# Altium schematic sheet 2.Connectors.SchDoc
size A4; SheetNumber: 3; SheetTotal: 13
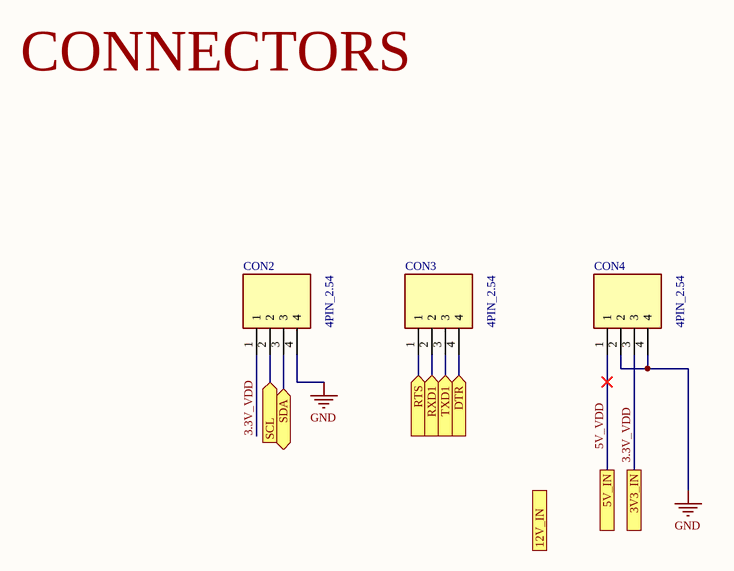
[diagram p0: 2.Connectors.SchDoc]

## Parts
CON2  4PIN_2.54  [4Pin_2.5]
CON3  4PIN_2.54  [4Pin_2.5]
CON4  4PIN_2.54  [4Pin_2.5]

## Ports
3V3_IN, 5V_IN, 12V_IN, DTR (in), RTS (in), RXD1 (in), SCL (in), SDA (bidir), TXD1 (in)

## Nets
GND: CON2.4 CON4.2 CON4.4
3.3V_VDD: CON2.1 CON4.3 ; port 3V3_IN
5V_VDD: CON4.1 ; port 5V_IN
DTR: CON3.4 ; port DTR
RTS: CON3.1 ; port RTS
RXD1: CON3.2 ; port RXD1
SCL: CON2.2 ; port SCL
SDA: CON2.3 ; port SDA
TXD1: CON3.3 ; port TXD1

## Notes on the sheet
- CONNECTORS

## Library data of the parts
CON2-CON4 = 4PIN_2.54: PN: 87224-4